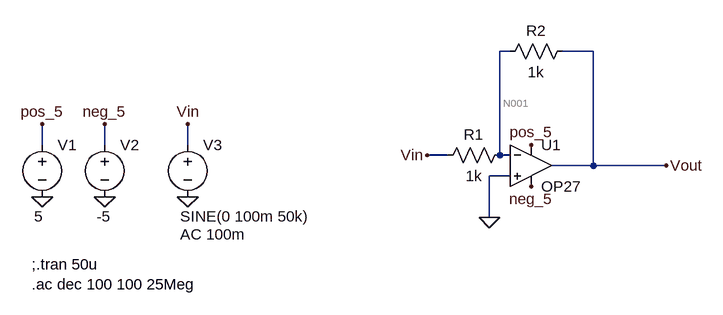
[diagram p0: schematic 1c.asc]
1c.asc, the LTspice schematic file:
Version 4
SHEET 1 1620 680
WIRE 32 -48 16 -48
WIRE 160 -48 112 -48
WIRE -688 96 -688 64
WIRE -592 96 -592 64
WIRE -464 96 -464 64
WIRE -64 112 -96 112
WIRE 16 112 16 -48
WIRE 32 112 16 112
WIRE 160 128 160 -48
WIRE 160 128 96 128
WIRE 272 128 160 128
WIRE 32 144 0 144
WIRE 0 208 0 144
FLAG -688 64 pos_5
FLAG -592 176 0
FLAG -592 64 neg_5
FLAG -688 176 0
FLAG -464 176 0
FLAG -464 64 Vin
FLAG 64 96 pos_5
FLAG 64 160 neg_5
FLAG -96 112 Vin
FLAG 272 128 Vout
FLAG 0 208 0
SYMBOL voltage -592 80 R0
WINDOW 123 0 0 Left 0
WINDOW 39 0 0 Left 0
WINDOW 3 -12 126 Left 2
SYMATTR Value -5
SYMATTR InstName V2
SYMBOL OpAmps\\OP27 64 64 R0
SYMATTR InstName U1
SYMBOL voltage -688 80 R0
WINDOW 123 0 0 Left 0
WINDOW 39 0 0 Left 0
WINDOW 3 -12 126 Left 2
SYMATTR Value 5
SYMATTR InstName V1
SYMBOL voltage -464 80 R0
WINDOW 123 -12 154 Left 2
WINDOW 39 0 0 Left 0
WINDOW 3 -12 126 Left 2
SYMATTR Value2 AC 100m
SYMATTR Value SINE(0 100m 50k)
SYMATTR InstName V3
SYMBOL res 32 96 R90
WINDOW 0 0 56 VBottom 2
WINDOW 3 32 56 VTop 2
SYMATTR InstName R1
SYMATTR Value 1k
SYMBOL res 128 -64 R90
WINDOW 0 0 56 VBottom 2
WINDOW 3 32 56 VTop 2
SYMATTR InstName R2
SYMATTR Value 1k
TEXT -704 280 Left 2 !;.tran 50u\n.ac dec 100 100 25Meg

The netlist it stands for:
* 1c.asc
V2 neg_5 0 -5
XU1 0 N001 pos_5 neg_5 Vout OP27  ; pins In+ In- V+ V- OUT
V1 pos_5 0 5
V3 Vin 0 SINE(0 100m 50k) AC 100m
R1 N001 Vin 1k
R2 Vout N001 1k
;.tran 50u
.ac dec 100 100 25Meg
.lib ADI.lib
.backanno
.end

* Results of the author's LTspice run, read from the files saved beside the schematic
* Operating Point, zero values left out:
*   V(neg_5) = -5 V
*   V(pos_5) = 5 V
*   I(V1) = -2.468 mA
*   I(V2) = 2.468 mA
*   Ix(u1:3) = 2.468 mA
*   Ix(u1:4) = -2.468 mA
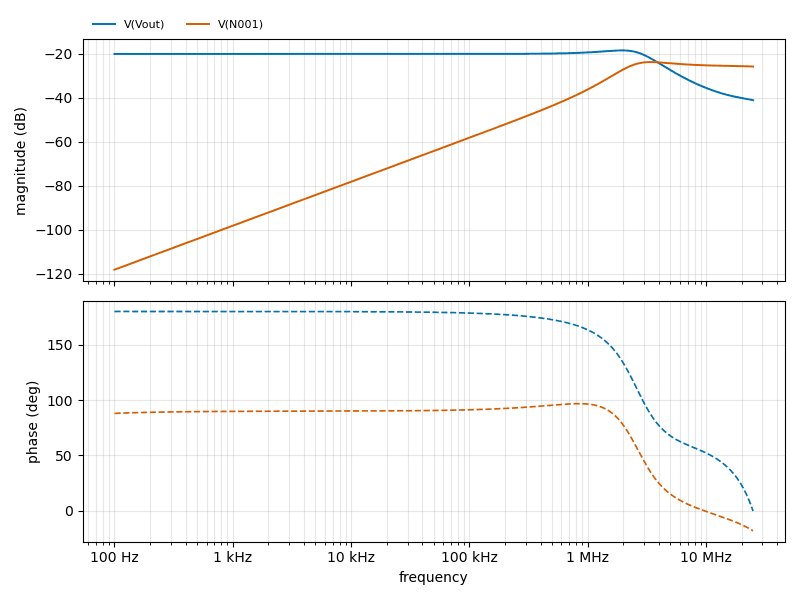
[diagram p1: AC Analysis of 1c.asc, plotted from the saved traces]
* AC Analysis, 1 run:
*   V(Vout): -20.00 dB at 100 Hz, -41.02 dB at 25 MHz, peak -18.38 dB at 1.95 MHz, 3 dB below the peak at 3.249 MHz
*   V(N001): -118.13 dB at 100 Hz, -25.71 dB at 25 MHz, peak -23.69 dB at 3.388 MHz, 3 dB below the peak at 2.055 MHz